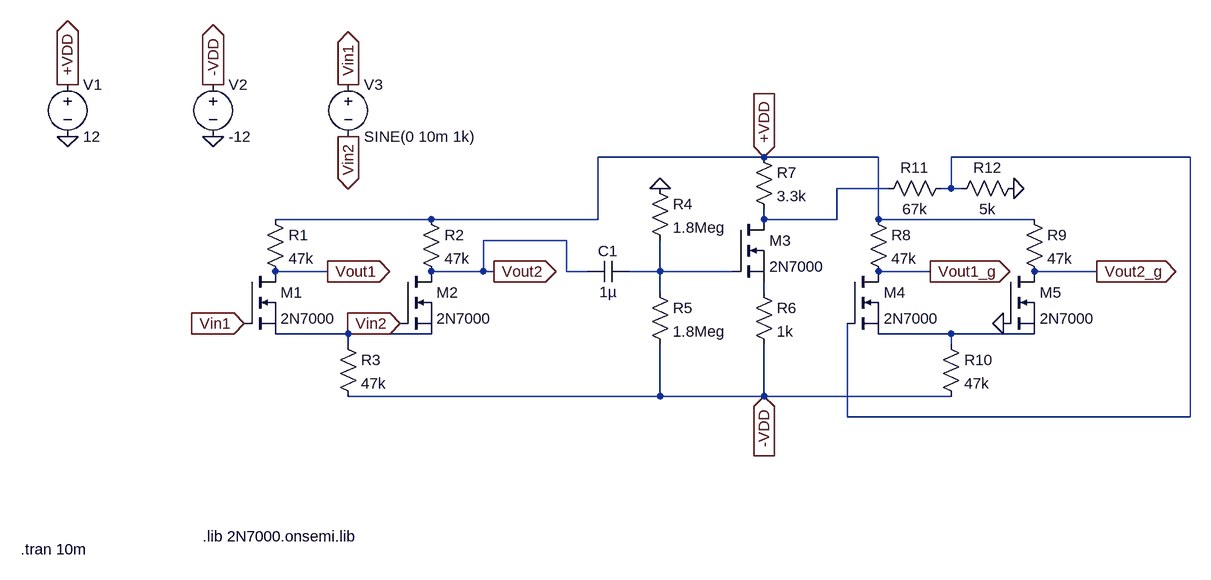
[diagram p0: schematic EW2_project1_final_hardware_compliant.asc]
EW2_project1_final_hardware_compliant.asc, the LTspice schematic file:
Version 4
SHEET 1 1500 680
WIRE 832 -64 576 -64
WIRE 1008 -64 832 -64
WIRE 1488 -64 1120 -64
WIRE 1024 -16 944 -16
WIRE 1120 -16 1120 -64
WIRE 1120 -16 1104 -16
WIRE 1136 -16 1120 -16
WIRE 320 32 80 32
WIRE 576 32 576 -64
WIRE 576 32 320 32
WIRE 832 32 832 16
WIRE 944 32 944 -16
WIRE 944 32 832 32
WIRE 1008 32 1008 -64
WIRE 1248 32 1008 32
WIRE 528 64 400 64
WIRE 160 112 80 112
WIRE 400 112 400 64
WIRE 400 112 320 112
WIRE 416 112 400 112
WIRE 528 112 528 64
WIRE 560 112 528 112
WIRE 672 112 672 64
WIRE 672 112 624 112
WIRE 784 112 672 112
WIRE 1088 112 1008 112
WIRE 1344 112 1248 112
WIRE 672 144 672 112
WIRE 832 144 832 128
WIRE 192 208 80 208
WIRE 320 208 192 208
WIRE 1120 208 1008 208
WIRE 1248 208 1120 208
WIRE 192 224 192 208
WIRE 1120 224 1120 208
WIRE 672 304 672 224
WIRE 672 304 192 304
WIRE 832 304 832 224
WIRE 832 304 672 304
WIRE 1120 304 832 304
WIRE 960 336 960 192
WIRE 1488 336 1488 -64
WIRE 1488 336 960 336
FLAG -240 -176 +VDD
IOPIN -240 -176 Out
FLAG -16 -176 -VDD
IOPIN -16 -176 Out
FLAG 192 -176 Vin1
IOPIN 192 -176 Out
FLAG 192 -96 Vin2
IOPIN 192 -96 Out
FLAG -16 -96 0
FLAG -240 -96 0
FLAG 416 112 Vout2
IOPIN 416 112 Out
FLAG 160 112 Vout1
IOPIN 160 112 Out
FLAG 672 -16 0
FLAG 1344 112 Vout2_g
IOPIN 1344 112 Out
FLAG 1088 112 Vout1_g
IOPIN 1088 112 Out
FLAG 1200 192 0
FLAG 32 192 Vin1
IOPIN 32 192 In
FLAG 272 192 Vin2
IOPIN 272 192 In
FLAG 832 -64 +VDD
IOPIN 832 -64 In
FLAG 832 304 -VDD
IOPIN 832 304 In
FLAG 1216 -16 0
SYMBOL nmos 32 112 R0
SYMATTR InstName M1
SYMATTR Value 2N7000
SYMATTR Prefix X
SYMBOL nmos 272 112 R0
SYMATTR InstName M2
SYMATTR Value 2N7000
SYMATTR Prefix X
SYMBOL voltage -240 -192 R0
WINDOW 123 0 0 Left 0
WINDOW 39 0 0 Left 0
SYMATTR InstName V1
SYMATTR Value 12
SYMBOL voltage -16 -192 R0
WINDOW 123 0 0 Left 0
WINDOW 39 0 0 Left 0
SYMATTR InstName V2
SYMATTR Value -12
SYMBOL voltage 192 -192 R0
WINDOW 123 0 0 Left 0
WINDOW 39 0 0 Left 0
SYMATTR InstName V3
SYMATTR Value SINE(0 10m 1k)
SYMBOL res 64 16 R0
SYMATTR InstName R1
SYMATTR Value 47k
SYMBOL res 304 16 R0
SYMATTR InstName R2
SYMATTR Value 47k
SYMBOL res 176 208 R0
SYMATTR InstName R3
SYMATTR Value 47k
SYMBOL cap 624 96 R90
WINDOW 0 0 32 VBottom 2
WINDOW 3 32 32 VTop 2
SYMATTR InstName C1
SYMATTR Value 1µ
SYMBOL res 656 -32 R0
SYMATTR InstName R4
SYMATTR Value 1.8Meg
SYMBOL res 656 128 R0
SYMATTR InstName R5
SYMATTR Value 1.8Meg
SYMBOL nmos 784 32 R0
SYMATTR InstName M3
SYMATTR Value 2N7000
SYMATTR Prefix X
SYMBOL res 816 128 R0
SYMATTR InstName R6
SYMATTR Value 1k
SYMBOL res 816 -80 R0
SYMATTR InstName R7
SYMATTR Value 3.3k
SYMBOL nmos 960 112 R0
SYMATTR InstName M4
SYMATTR Value 2N7000
SYMATTR Prefix X
SYMBOL nmos 1200 112 R0
SYMATTR InstName M5
SYMATTR Value 2N7000
SYMATTR Prefix X
SYMBOL res 992 16 R0
SYMATTR InstName R8
SYMATTR Value 47k
SYMBOL res 1232 16 R0
SYMATTR InstName R9
SYMATTR Value 47k
SYMBOL res 1104 208 R0
SYMATTR InstName R10
SYMATTR Value 47k
SYMBOL res 1120 -32 R90
WINDOW 0 0 56 VBottom 2
WINDOW 3 32 56 VTop 2
SYMATTR InstName R11
SYMATTR Value 67k
SYMBOL res 1232 -32 R90
WINDOW 0 0 56 VBottom 2
WINDOW 3 32 56 VTop 2
SYMATTR InstName R12
SYMATTR Value 5k
TEXT -32 520 Left 2 !.lib 2N7000.onsemi.lib
TEXT -312 540 Left 2 !.tran 10m

The netlist it stands for:
* EW2_project1_final_hardware_compliant.asc
XM1 Vout1 Vin1 N005 2N7000  ; pins D G S
XM2 Vout2 Vin2 N005 2N7000  ; pins D G S
V1 +VDD 0 12
V2 -VDD 0 -12
V3 Vin1 Vin2 SINE(0 10m 1k)
R1 +VDD Vout1 47k
R2 +VDD Vout2 47k
R3 N005 -VDD 47k
C1 N003 Vout2 1µ
R4 0 N003 1.8Meg
R5 N003 -VDD 1.8Meg
XM3 N002 N003 N004 2N7000  ; pins D G S
R6 N004 -VDD 1k
R7 +VDD N002 3.3k
XM4 Vout1_g N001 N006 2N7000  ; pins D G S
XM5 Vout2_g 0 N006 2N7000  ; pins D G S
R8 +VDD Vout1_g 47k
R9 +VDD Vout2_g 47k
R10 N006 -VDD 47k
R11 N001 N002 67k
R12 0 N001 5k
.lib 2N7000.onsemi.lib
.tran 10m
.backanno
.end